# EAGLE design pedal_babnik (EAGLE 5.07)
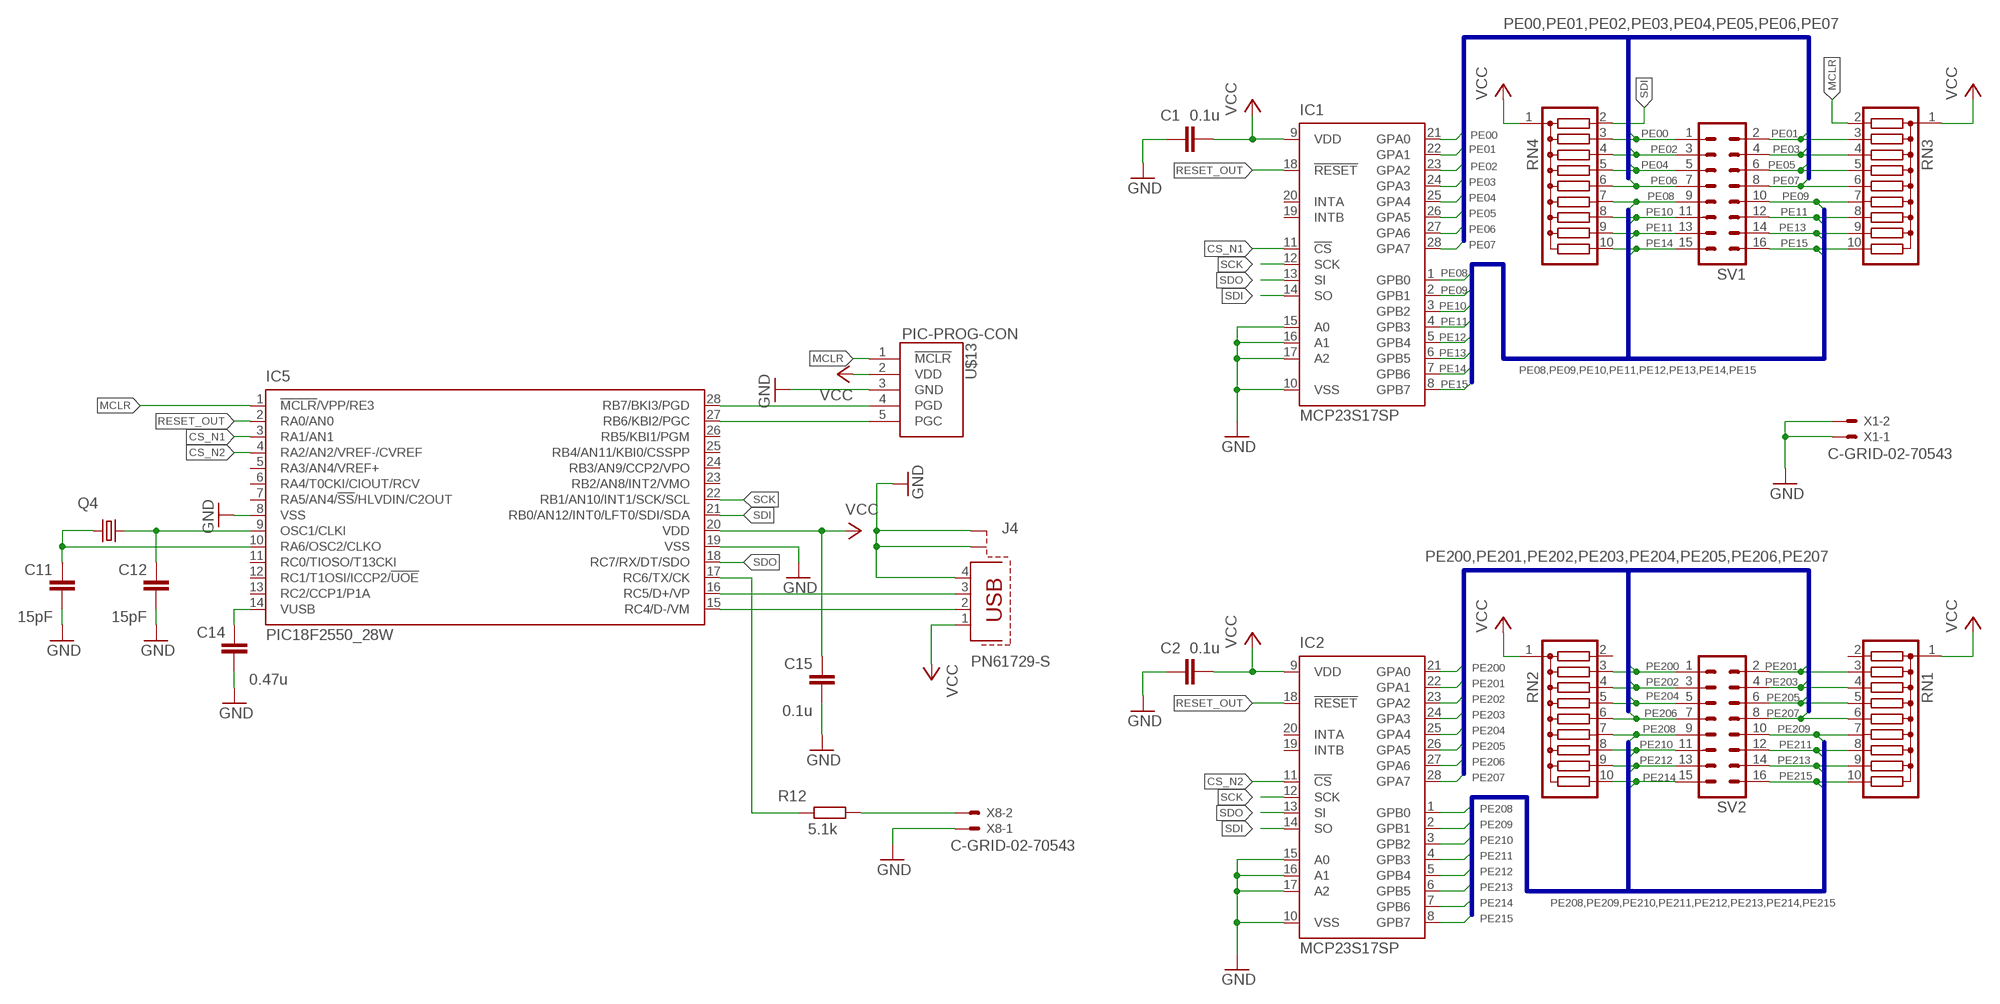
[diagram p0: schematic, sheet 1]

## Parts
C1  0.1u  C-EUC1206  [C1206]
C2  0.1u  C-EUC1206  [C1206]
C11  15pF  C-EUC1206  [C1206]
C12  15pF  C-EUC1206  [C1206]
C14  0.47u  C-EUC1206  [C1206]
C15  0.1u  C-EUC1206  [C1206]
IC1  MCP23S17SP  [DIL28-3]
IC2  MCP23S17SP  [DIL28-3]
IC5  PIC18F2550_28W  [SO28W]
J4  PN61729-S  [PN61729-S]
Q4  CRYSTALHC49S  [HC49/S]
R12  5.1k  R-EU_M1206  [M1206]
RN1  G09R  [SIL10]
RN2  G09R  [SIL10]
RN3  G09R  [SIL10]
RN4  G09R  [SIL10]
SV1  ML16  [ML16]
SV2  ML16  [ML16]
U$13  PIC-PROG-CON  [PIC-PROG-CON]
X1  C-GRID-02-70543  [70543-02]
X8  C-GRID-02-70543  [70543-02]

## Nets
CS_N1: IC1.11(!CS) IC5.3(RA1/AN1)
CS_N2: IC2.11(!CS) IC5.4(RA2/AN2/VREF-/CVREF)
GND [net16]: C1.2 C2.2 C11.1 C12.1 C14.1 C15.1 IC1.10(VSS) IC1.15(A0) IC1.16(A1) IC1.17(A2) IC2.10(VSS) IC2.15(A0) IC2.16(A1) IC2.17(A2) IC5.8(VSS) IC5.19(VSS) J4.4 J4.S1 J4.S2 U$13.3(GND) X1.1 X1.2 X8.1
MCLR: RN3.2 U$13.1(!MCLR)
N$23 [net12]: C12.2 IC5.9(OSC1/CLKI) Q4.2
N$24 [net12]: C11.2 IC5.10(RA6/OSC2/CLKO) Q4.1
N$25 [net12]: C14.2 IC5.14(VUSB)
N$32 [net12]: IC5.15(RC4/D-/VM) J4.2
N$33 [net12]: IC5.16(RC5/D+/VP) J4.3
N$34 [net12]: IC5.17(RC6/TX/CK) R12.2
N$35 [net12]: R12.1 X8.2
PE00: IC1.21(GPA0) RN4.3 SV1.1
PE01: IC1.22(GPA1) RN3.3 SV1.2
PE02: IC1.23(GPA2) RN4.4 SV1.3
PE03: IC1.24(GPA3) RN3.4 SV1.4
PE04: IC1.25(GPA4) RN4.5 SV1.5
PE05: IC1.26(GPA5) RN3.5 SV1.6
PE06: IC1.27(GPA6) RN4.6 SV1.7
PE07: IC1.28(GPA7) RN3.6 SV1.8
PE08: IC1.1(GPB0) RN4.7 SV1.9
PE09: IC1.2(GPB1) RN3.7 SV1.10
PE10: IC1.3(GPB2) RN4.8 SV1.11
PE11: IC1.4(GPB3) RN3.8 RN4.9 SV1.12 SV1.13
PE12: IC1.5(GPB4)
PE13: IC1.6(GPB5) RN3.9 SV1.14
PE14: IC1.7(GPB6) RN4.10 SV1.15
PE15: IC1.8(GPB7) RN3.10 SV1.16
PE200: IC2.21(GPA0) RN2.3 SV2.1
PE201: IC2.22(GPA1) RN1.3 SV2.2
PE202: IC2.23(GPA2) RN2.4 SV2.3
PE203: IC2.24(GPA3) RN1.4 SV2.4
PE204: IC2.25(GPA4) RN2.5 SV2.5
PE205: IC2.26(GPA5) RN1.5 SV2.6
PE206: IC2.27(GPA6) RN2.6 SV2.7
PE207: IC2.28(GPA7) RN1.6 SV2.8
PE208: IC2.1(GPB0) RN2.7 SV2.9
PE209: IC2.2(GPB1) RN1.7 SV2.10
PE210: IC2.3(GPB2) RN2.8 SV2.11
PE211: IC2.4(GPB3) RN1.8 SV2.12
PE212: IC2.5(GPB4) RN2.9 SV2.13
PE213: IC2.6(GPB5) RN1.9 SV2.14
PE214: IC2.7(GPB6) RN2.10 SV2.15
PE215: IC2.8(GPB7) RN1.10 SV2.16
RESET_OUT: IC1.18(!RESET) IC2.18(!RESET) IC5.2(RA0/AN0)
SCK: IC1.12(SCK) IC2.12(SCK) IC5.22(RB1/AN10/INT1/SCK/SCL)
SDI: IC1.14(SO) IC2.14(SO) IC5.21(RB0/AN12/INT0/LFT0/SDI/SDA) RN4.2
SDO: IC1.13(SI) IC2.13(SI) IC5.18(RC7/RX/DT/SDO)
UPR_K0: IC5.27(RB6/KBI2/PGC) U$13.5(PGC)
UPR_K1: IC5.28(RB7/BKI3/PGD) U$13.4(PGD)
VCC [net16]: C1.1 C2.1 C15.2 IC1.9(VDD) IC2.9(VDD) IC5.20(VDD) J4.1 RN1.1 RN2.1 RN3.1 RN4.1 U$13.2(VDD)
Unconnected: IC1.19(INTB) IC1.20(INTA) IC2.19(INTB) IC2.20(INTA) IC5.1(!MCLR!/VPP/RE3) IC5.5(RA3/AN4/VREF+) IC5.6(RA4/T0CKI/CIOUT/RCV) IC5.7(RA5/AN4/!SS!/HLVDIN/C2OUT) IC5.11(RC0/TIOSO/T13CKI) IC5.12(RC1/T1OSI/ICCP2/!UOE) IC5.13(RC2/CCP1/P1A) IC5.23(RB2/AN8/INT2/VMO) IC5.24(RB3/AN9/CCP2/VPO) IC5.25(RB4/AN11/KBI0/CSSPP) IC5.26(RB5/KBI1/PGM) RN1.2 RN2.2

## Buses
PE00,PE01,PE02,PE03,PE04,PE05,PE06,PE07
PE08,PE09,PE10,PE11,PE12,PE13,PE14,PE15
PE200,PE201,PE202,PE203,PE204,PE205,PE206,PE207
PE208,PE209,PE210,PE211,PE212,PE213,PE214,PE215

## Library data of the parts
C1 C2 C11 C12 C14 C15 = rcl:C-EU: CAPACITOR, European symbol
IC1 IC2 = microchip:MCP23S17: http://ww1.microchip.com/downloads/en/DeviceDoc/21952a.pdf Source: http://ww1.microchip.com/downloads/en/DeviceDoc/21952a.pdf
IC5 = microchip:PIC18F2*_28: USB Microcontrollers with nanoWatt Technology High-Performance, Enhanced Flash, 28/40/44-Pin, Source: http://ww1.microchip.com/downloads/en/devicedoc/39632c.pdf
J4 = con-berg:PN61729-S: BERG USB connector
Q4 = crystal:CRYSTAL: CRYSTAL
R12 = rcl:R-EU_: RESISTOR, European symbol
RN1-RN4 = resistor-sil:G09R: SIL RESISTOR
SV1 SV2 = con-ml:ML16: HARTING
U$13 = pic_prog_con:PIC-PROG-CON: pic prog con pic_prog pic_prog_con
X1 X8 = con-molex:C-GRID-02: CONNECTOR wire to board 2.54 mm (0.100") pitch header

## Net classes
2 net12: width 0.305 mm
5 net16: width 0.406 mm

## Board
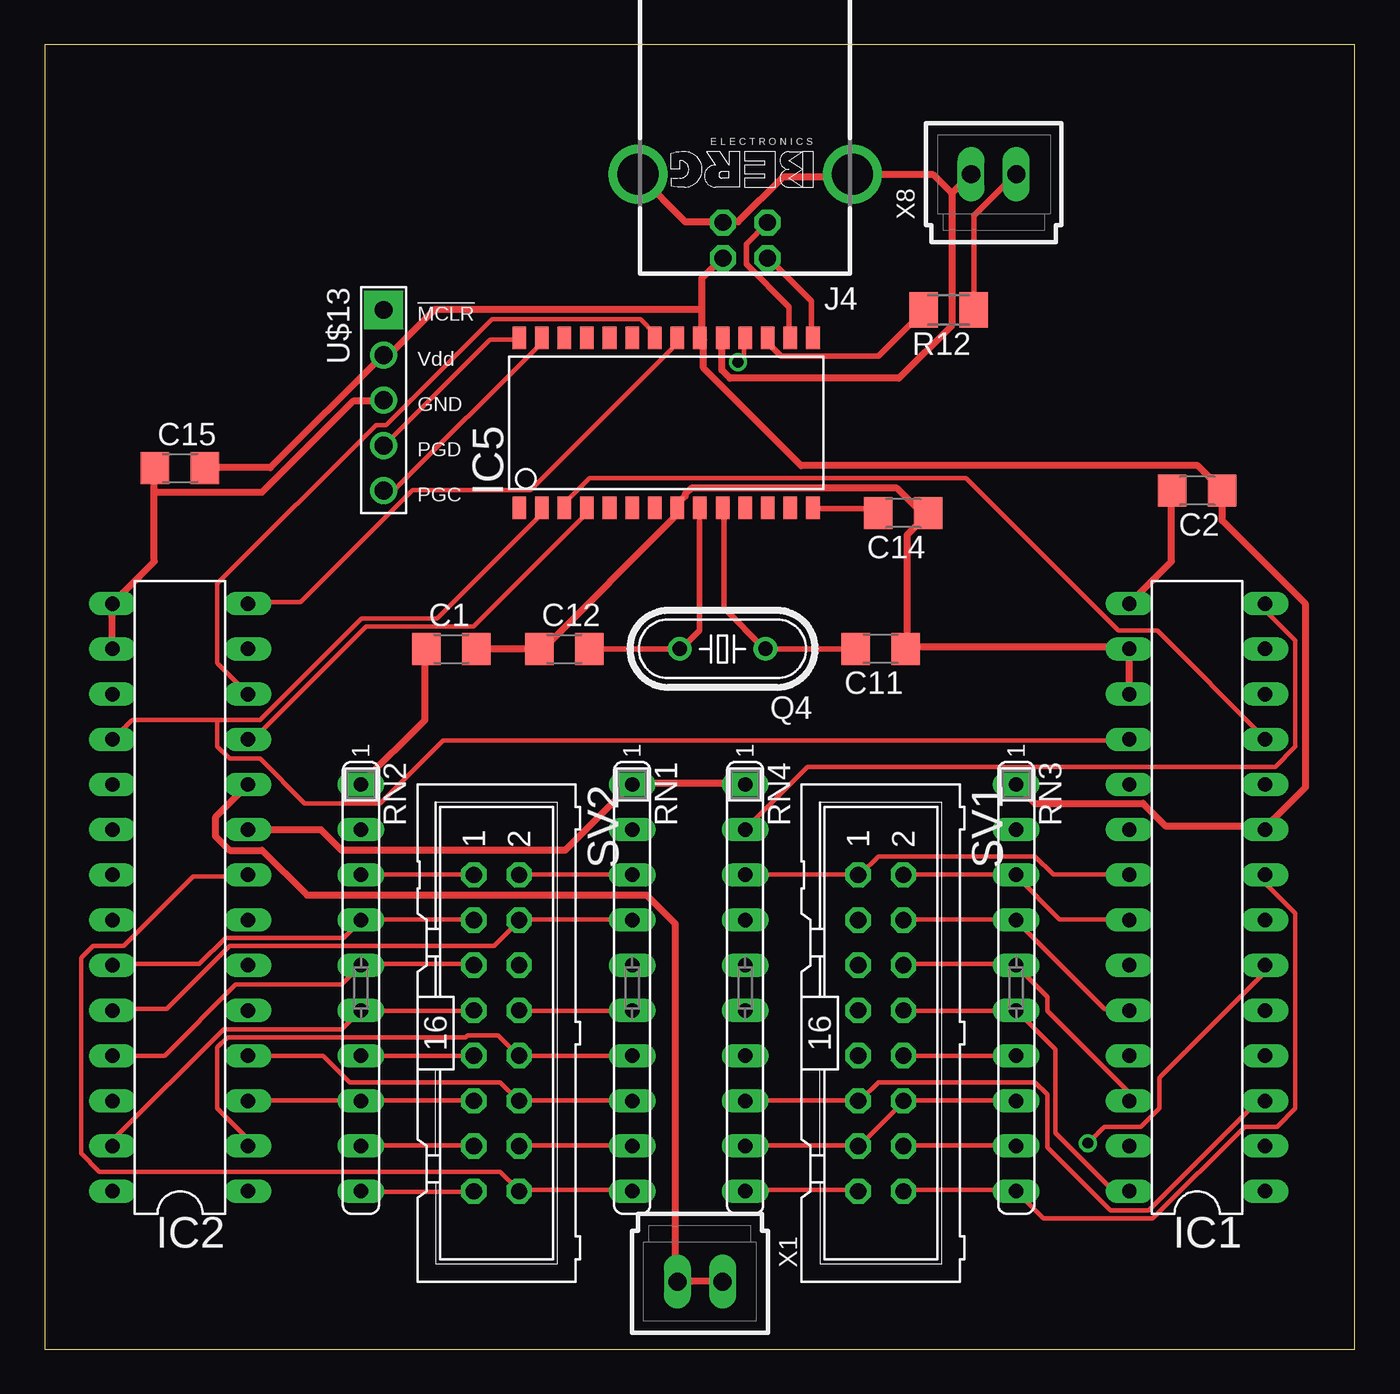
[diagram p1: board, top side]
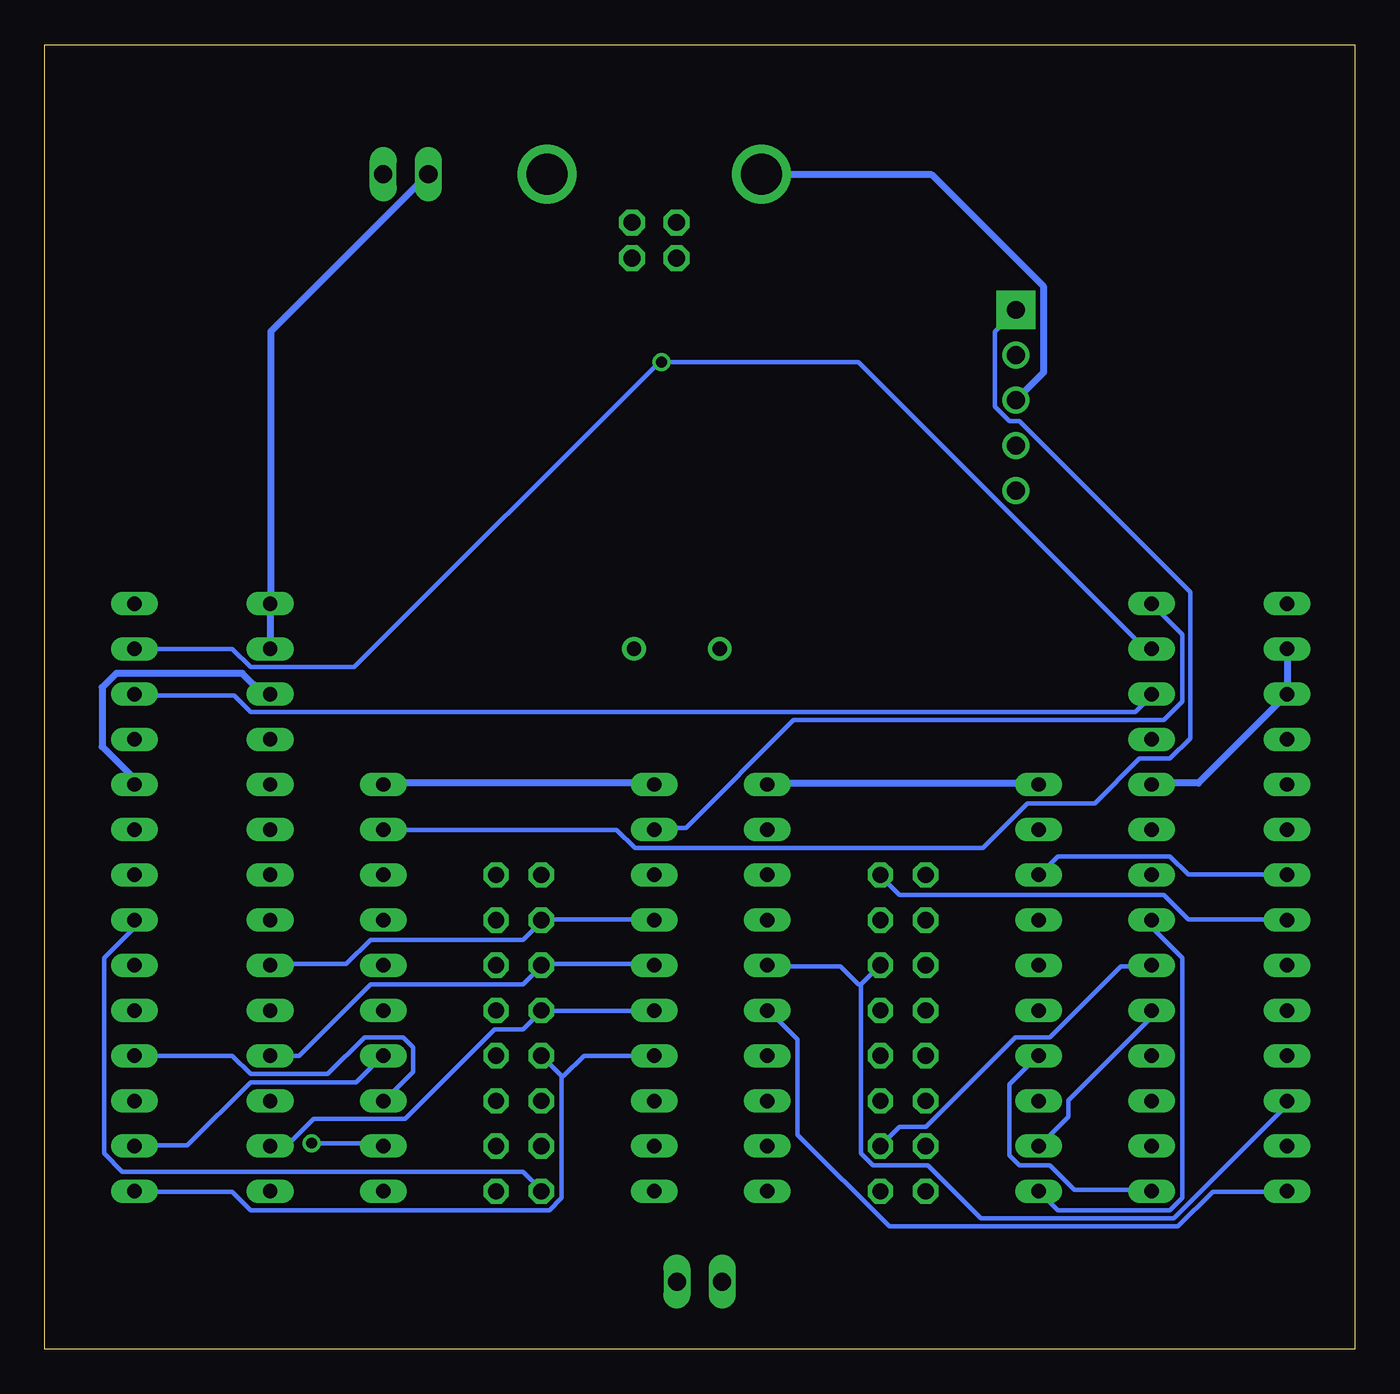
[diagram p2: board, bottom side, seen from below]

Size 73.64 x 73.33 mm. Coordinates in mm from the lower left corner, seen from the top.
Outline: 0,0 73.64,0 73.64,73.33 0,73.33 0,0
Copper layers (1*16): Top 0.035mm / dielectric 1.5mm / Bottom 0.035mm
Design rules "default": minimum track width 10mil, minimum drill 24mil, track to track 8mil, track to pad 8mil, pad to pad 8mil, via to via 8mil, smd to smd 8mil, copper to edge 40mil, drill to drill 8mil, minimum pad ring 10mil, minimum via ring 8mil, stop-mask expansion 4mil, vias tented up to drill 0mil, thermal gap 10mil

### Footprints (pad centres in the part's own frame; a part is rotated, then mirrored left to right if it is on the bottom)
C1206 = smd 1.6 x 1.8: 1 -1.4,0; 2 1.4,0
DIL28-3 = drill 0.813 long: 1 -16.51,-3.81; 2 -13.97,-3.81; 3 -11.43,-3.81; 4 -8.89,-3.81; 5 -6.35,-3.81; 6 -3.81,-3.81; 7 -1.27,-3.81; 8 1.27,-3.81; 9 3.81,-3.81; 10 6.35,-3.81; 11 8.89,-3.81; 12 11.43,-3.81; 13 13.97,-3.81; 14 16.51,-3.81; 15 16.51,3.81; 16 13.97,3.81; 17 11.43,3.81; 18 8.89,3.81; 19 6.35,3.81; 20 3.81,3.81; 21 1.27,3.81; 22 -1.27,3.81; 23 -3.81,3.81; 24 -6.35,3.81; 25 -8.89,3.81; 26 -11.43,3.81; 27 -13.97,3.81; 28 -16.51,3.81
SO28W = smd 0.762 x 1.27: 1 -7.62,-4.78; 2 -6.35,-4.78; 3 -5.08,-4.78; 4 -3.81,-4.78; 5 -2.54,-4.78; 6 -1.27,-4.78; 7 0,-4.78; 8 1.27,-4.78; 9 2.54,-4.78; 10 3.81,-4.78; 11 5.08,-4.78; 12 6.35,-4.78; 13 7.62,-4.78; 14 8.89,-4.78; 15 8.89,4.78; 16 7.62,4.78; 17 6.35,4.78; 18 5.08,4.78; 19 3.81,4.78; 20 2.54,4.78; 21 1.27,4.78; 22 0,4.78; 23 -1.27,4.78; 24 -2.54,4.78; 25 -3.81,4.78; 26 -5.08,4.78; 27 -6.35,4.78; 28 -7.62,4.78
PN61729-S = drill 0.95 octagon: 1 1.25,4.71; 2 -1.25,4.71; 3 -1.25,2.71; 4 1.25,2.71 | drill 2.3 pad 2.9: S1 -6.02,0; S2 6.02,0
HC49/S = drill 0.813: 1 -2.413,0; 2 2.413,0
M1206 = smd 1.6 x 2: 1 -1.4,0; 2 1.4,0
SIL10 = drill 0.813 long: 1 -11.43,0; 2 -8.89,0; 3 -6.35,0; 4 -3.81,0; 5 -1.27,0; 6 1.27,0; 7 3.81,0; 8 6.35,0; 9 8.89,0; 10 11.43,0
ML16 = drill 0.914 octagon: 1 -8.89,-1.27; 2 -8.89,1.27; 3 -6.35,-1.27; 4 -6.35,1.27; 5 -3.81,-1.27; 6 -3.81,1.27; 7 -1.27,-1.27; 8 -1.27,1.27; 9 1.27,-1.27; 10 1.27,1.27; 11 3.81,-1.27; 12 3.81,1.27; 13 6.35,-1.27; 14 6.35,1.27; 15 8.89,-1.27; 16 8.89,1.27
PIC-PROG-CON = drill 1 pad 2.184 square: 1 -3.81,0 | drill 1: 2 -1.27,0; 3 1.27,0; 4 3.81,0; 5 6.35,0
70543-02 = drill 1.016 long: 1 -1.27,0; 2 1.27,0

### Placement (x,y rotation side)
C1  22.86,39.37 0 top
C2  64.77,48.26 180 top
C11  46.99,39.37 180 top
C12  29.21,39.37 0 top
C14  48.26,46.99 180 top
C15  7.62,49.53 0 top
IC1  64.77,25.4 90 top
IC2  7.62,25.4 90 top
IC5  34.29,52.07 0 top
J4  39.37,66.04 180 top
Q4  38.1,39.37 180 top
R12  50.8,58.42 180 top
RN1  33.02,20.32 270 top
RN2  17.78,20.32 270 top
RN3  54.61,20.32 270 top
RN4  39.37,20.32 270 top
SV1  46.99,17.78 270 top
SV2  25.4,17.78 270 top
U$13  19.05,54.61 270 top
X1  36.83,3.81 180 top
X8  53.34,66.04 0 top

### Tracks (layer width: path | path; a pad name or v marks a point on that pad's centre or on a via)
CS_N1
  Top 0.254: IC5.3 29.26,47.37 29.26,47.6 30.63,48.97 51.78,48.97 60.35,40.4 62.52,40.4 68.58,34.34 IC1.11
CS_N2
  Top 0.254: IC5.4 30.4,47.26 30.4,46.91 24.12,40.63 18.06,40.63 11.77,34.34 11.43,34.34 IC2.11
GND
  Top 0.406: C1.2 C12.1 28,39.37 35.55,46.91 35.55,47.26 IC5.8 35.55,47.48 36.01,47.94 36.01,48.06 36.35,48.4 47.89,48.4 49.38,46.91 C14.1 49.61,46.91 48.46,45.77 48.46,39.37 C11.1 48.58,39.48 60.81,39.48 IC1.16 60.92,39.37 60.92,36.85 IC1.17 | C2.2 63.32,48.17 63.32,44.28 61.04,42 IC1.15 | J4.S2 33.38,66 36.01,63.37 38.06,63.37 J4.4 38.29,63.37 38.98,63.37 41.49,65.89 45.26,65.89 J4.S1 45.49,66 49.95,66 50.98,64.97 | 50.98,64.97 50.98,57.54 48.01,54.57 38.52,54.57 38.06,55.03 38.06,56.74 IC5.19 | 50.98,64.97 52.01,66 X8.1 | 6.17,48.17 6.17,44.28 3.89,42 IC2.15 3.77,41.77 3.77,39.37 IC2.16 | 6.17,48.17 6.17,49.43 C15.1 | 6.17,48.17 12.23,48.17 17.37,53.31 18.97,53.31 U$13.3 | X1.1 38.06,3.82 35.66,3.82 X1.2 35.43,3.94 35.43,23.94 33.83,25.54 14.74,25.54 12.23,28.05 10.4,28.05 9.6,28.85 9.6,29.88 11.43,31.71 IC2.10
  Bottom 0.406: IC1.10 68.58,32.05 70.41,33.88 70.41,37.2 69.61,38 62.52,38 61.38,36.85 61.04,36.85 IC1.17 | IC1.16 60.92,39.37 60.92,41.88 IC1.15 60.92,42.11 60.92,57.2 52.12,66 X8.1 | IC2.10 11.43,31.83 8.8,31.83 3.89,36.74 IC2.17 3.77,36.97 3.77,39.37 IC2.16 | J4.S2 33.26,66 23.77,66 17.49,59.71 17.49,54.91 18.97,53.43 U$13.3
MCLR
  Bottom 0.254: RN3.2 54.52,29.2 41.49,29.2 40.46,28.17 20.92,28.17 18.4,30.68 14.63,30.68 12.12,33.2 10.4,33.2 9.26,34.34 9.26,42.57 18.86,52.17 19.43,52.17 20.23,52.97 20.23,57.2 19.09,58.34 U$13.1
N$23
  Top 0.305: IC5.9 36.8,47.26 36.8,40.4 35.78,39.37 Q4.2 C12.2
N$24
  Top 0.305: IC5.10 38.18,47.26 38.18,41.66 40.46,39.37 Q4.1 C11.2
N$25
  Top 0.305: IC5.14 43.2,47.26 46.52,47.26 46.75,47.03 C14.2
N$32
  Top 0.305: IC5.15 43.09,56.86 43.09,58.91 40.69,61.32 J4.2
N$33
  Top 0.305: IC5.16 41.83,56.86 41.83,58.57 39.43,60.97 39.43,62.12 40.58,63.26 J4.3
N$34
  Top 0.305: IC5.17 40.69,56.74 40.69,56.52 41.38,55.83 46.86,55.83 49.38,58.34 R12.2
N$35
  Top 0.305: R12.1 52.23,58.46 52.23,63.72 54.52,66 X8.2
PE00
  Top 0.254: RN4.3 39.43,26.68 45.72,26.68 SV1.1 45.83,26.68 46.86,27.71 55.66,27.71 56.69,26.68 60.92,26.68 IC1.21
PE01
  Top 0.254: SV1.2 48.35,26.68 54.52,26.68 RN3.3 54.63,26.57 57.04,24.17 60.92,24.17 IC1.22
PE02
  Bottom 0.254: IC1.23 60.92,21.65 56.69,21.65 55.32,23.02 46.75,23.02 45.72,24.05 SV1.3 45.61,24.17 39.43,24.17 RN4.4
PE03
  Top 0.254: SV1.4 48.35,24.17 54.52,24.17 RN3.4 54.63,24.05 59.55,19.14 60.92,19.14 IC1.24
PE04
  Bottom 0.254: IC1.25 59.32,16.51 55.32,20.51 46.75,20.51 45.72,21.54 SV1.5 45.61,21.65 39.43,21.65 RN4.5
PE05
  Top 0.254: SV1.6 48.35,21.65 54.52,21.65 RN3.5 54.63,21.54 56.35,19.83 56.35,19.02 60.92,14.45 60.92,13.99 IC1.26
PE06
  Bottom 0.254: IC1.27 60.92,11.48 60.01,11.48 58.52,12.97 53.38,12.97 48.35,18 46.75,18 45.72,19.02 SV1.7 45.61,19.02 39.43,19.02 RN4.6
PE07
  Top 0.254: IC1.28 60.92,8.97 60.01,8.97 56.81,12.17 56.81,16.85 RN3.6 54.52,19.02 48.35,19.02 SV1.8
PE08
  Bottom 0.254: 44.58,15.37 44.58,8.51 45.26,7.82 62.06,7.82 63.09,8.85 68.58,8.85 IC1.1 | SV1.9 44.58,15.37 | RN4.7 43.32,16.51 44.46,15.37 44.58,15.37
PE09
  Top 0.254: SV1.10 RN3.7
  Bottom 0.254: IC1.2 68.58,11.48 65.61,11.48 62.06,15.02 56.12,15.02 54.63,16.51 RN3.7
PE10
  Top 0.254: RN4.8 39.43,13.99 45.72,13.99 SV1.11 45.83,13.99 46.86,15.02 55.66,15.02 56.35,14.34 56.35,11.37 59.89,7.82 62.06,7.82 68.12,13.88 68.58,13.88 IC1.3
PE11
  Top 0.254: RN4.9 39.43,11.48 45.72,11.48 SV1.13 45.83,11.48 48.23,13.88 SV1.12 48.35,13.99 54.52,13.99 RN3.8
  Bottom 0.254: IC1.4 63.09,16.51 62.06,15.48 57.72,15.48 55.66,17.54 53.49,17.54 52.92,16.97 52.92,15.6 54.52,13.99 RN3.8
PE13  (via drill 0.61)
  Top 0.254: RN3.9 54.52,11.48 48.35,11.48 SV1.14 | IC1.6 68.58,21.2 62.64,15.25 62.64,13.54 61.61,12.51 59.55,12.51 v58.64,11.6
  Bottom 0.254: v58.64,11.6 54.75,11.6 54.63,11.48 RN3.9
PE14
  Top 0.254: RN4.10 39.43,8.97 45.72,8.97 SV1.15
  Bottom 0.254: IC1.7 68.58,23.71 70.29,22 70.29,11.02 69.27,9.99 46.75,9.99 45.72,8.97 SV1.15
PE15
  Top 0.254: SV1.16 48.35,8.97 54.52,8.97 RN3.10 54.63,8.85 56.12,7.37 62.29,7.37 67.44,12.51 69.27,12.51 70.29,13.54 70.29,24.51 68.58,26.23 IC1.8
PE200
  Top 0.254: SV2.1 24.12,26.68 17.83,26.68 RN2.3
  Bottom 0.254: IC2.21 3.89,26.68 9.37,26.68 10.4,27.71 16.69,27.71 17.72,26.68 RN2.3
PE201
  Top 0.254: RN1.3 32.92,26.68 26.75,26.68 SV2.2
  Bottom 0.254: IC2.22 3.89,24.17 9.37,24.17 10.74,25.54 25.6,25.54 26.63,26.57 SV2.2
PE202
  Top 0.254: IC2.23 3.89,21.65 8.69,21.65 10.17,23.14 16.8,23.14 17.72,24.05 RN2.4 17.83,24.17 24.12,24.17 SV2.3
PE203
  Top 0.254: IC2.24 3.89,19.14 6.86,19.14 10.4,22.68 25.26,22.68 26.63,24.05 SV2.4 26.75,24.17 32.92,24.17 RN1.4
PE204
  Top 0.254: IC2.25 6.74,16.51 10.74,20.51 16.69,20.51 17.72,21.54 RN2.5 17.83,21.65 24.12,21.65 SV2.5
PE205
  Bottom 0.254: 27.77,20.51 27.77,11.02 27.09,10.34 24,10.34 21.03,7.37 10.17,7.37 3.89,13.65 3.89,13.88 IC2.26 | 27.77,20.51 26.75,21.54 SV2.6 | RN1.5 32.92,21.54 28.92,21.54 27.89,20.51 27.77,20.51
PE206
  Top 0.254: IC2.27 3.89,11.48 3.89,11.82 10.06,18 16.69,18 17.72,19.02 RN2.6 17.83,19.02 24.12,19.02 SV2.7
PE207
  Top 0.254: SV2.8 26.75,19.02 32.92,19.02 RN1.6
  Bottom 0.254: IC2.28 3.89,8.85 8,8.85 9.94,6.91 26.18,6.91 31.32,12.05 31.32,17.42 32.92,19.02 RN1.6
PE208
  Top 0.254: RN2.7 SV2.9
  Bottom 0.254: IC2.1 11.43,8.97 15.77,8.97 17.14,10.34 18.86,10.34 19.43,10.91 19.43,14.91 17.83,16.51 RN2.7
PE209
  Top 0.254: IC2.2 11.43,11.82 9.72,13.54 9.72,16.97 10.29,17.54 23.66,17.54 23.77,17.65 25.49,17.65 26.63,16.51 SV2.10 RN1.7
PE210
  Top 0.254: IC2.3 11.43,13.99 17.72,13.99 RN2.8 17.83,13.99 24.12,13.99 SV2.11
PE211
  Top 0.254: RN1.8 32.92,13.99 26.75,13.99 SV2.12 26.63,13.99 25.6,15.02 17.14,15.02 15.66,16.51 IC2.4
PE212
  Top 0.254: SV2.13 24.12,11.48 17.83,11.48 RN2.9
  Bottom 0.254: IC2.5 11.43,18.68 16.12,13.99 16.12,13.08 17.72,11.48 RN2.9
PE213
  Top 0.254: RN1.9 32.92,11.48 26.75,11.48 SV2.14
  Bottom 0.254: IC2.6 11.43,21.54 13.14,21.54 17.14,17.54 19.09,17.54 24.12,12.51 25.6,12.51 26.63,11.48 SV2.14
PE214
  Top 0.254: SV2.15 24.12,8.85 17.83,8.85 RN2.10
  Bottom 0.254: IC2.7 11.43,23.71 9.72,22 9.72,8.51 10.4,7.82 16.69,7.82 17.72,8.85 RN2.10
PE215
  Top 0.254: IC2.8 11.43,26.57 8.34,26.57 4.46,22.68 2.74,22.68 2.06,22 2.06,11.02 3.09,9.99 25.6,9.99 26.63,8.97 SV2.16 26.75,8.97 32.92,8.97 RN1.10
RESET_OUT
  Top 0.254: 9.72,35.37 4.92,35.37 3.89,34.34 IC2.18 | 9.72,35.37 12.12,35.37 17.83,41.08 22.06,41.08 27.89,46.91 27.89,47.26 IC5.2 | 9.72,35.37 9.72,33.88 10.4,33.2 12.12,33.2 14.63,30.68 18.86,30.68 22.4,34.23 60.92,34.23 IC1.18
SCK
  Top 0.254: IC5.22 34.29,57.09 33.49,57.89 25.15,57.89 19.2,51.94 18.63,51.94 9.72,43.03 9.72,38.57 11.43,36.85 IC2.12
  Bottom 0.254: IC1.12 68.58,36.74 62.98,36.74 62.06,35.83 12.34,35.83 11.43,36.74 IC2.12
SDI
  Top 0.254: IC5.21 35.55,56.74 35.55,56.52 27.32,48.28 20.69,48.28 14.4,42 11.43,42 IC2.14 | IC1.14 68.58,41.54 70.29,39.83 70.29,33.88 69.15,32.74 42.86,32.74 39.43,29.31 RN4.2
  Bottom 0.254: RN4.2 39.32,29.31 37.6,29.31 31.55,35.37 10.74,35.37 9.72,36.4 9.72,40.17 11.43,41.88 IC2.14
SDO  (via drill 0.61)
  Top 0.254: v38.98,55.49 39.32,55.83 39.32,56.74 IC5.18
  Bottom 0.254: IC2.13 11.77,39.37 27.89,55.49 v38.98,55.49 39.09,55.49 56.24,38.34 62.06,38.34 63.09,39.37 IC1.13
UPR_K0
  Top 0.254: IC5.27 27.89,56.74 27.89,56.52 19.66,48.28 19.09,48.28 U$13.5
UPR_K1
  Top 0.254: IC5.28 26.63,56.74 25.03,56.74 19.09,50.8 U$13.4
VCC
  Top 0.406: 36.92,58.46 36.92,60.17 38.06,61.32 J4.1 | 36.92,58.46 36.92,56.86 IC5.20 37.03,56.74 37.03,55.14 42.52,49.66 64.81,49.66 66.06,48.4 C2.1 66.18,48.17 66.18,46.57 70.87,41.88 70.87,31.6 68.58,29.31 IC1.9 68.47,29.43 62.98,29.43 61.72,30.68 55.66,30.68 54.63,31.71 RN3.1 | C15.2 9.03,49.54 12.69,49.54 18.97,55.83 U$13.2 19.2,55.94 19.43,55.94 21.95,58.46 36.92,58.46 | C1.1 21.37,39.37 21.37,35.37 17.83,31.83 RN2.1 | IC2.9 11.43,29.2 15.54,29.2 16.69,28.05 29.26,28.05 32.92,31.71 RN1.1 33.15,31.83 39.32,31.83 RN4.1
  Bottom 0.406: RN3.1 54.52,31.83 39.43,31.83 RN4.1 | RN2.1 17.83,31.83 32.92,31.83 RN1.1